# Altium schematic sheet camera_hdmi.SchDoc
size 431 x 279 mm; SheetNumber: 4; SheetTotal: 5
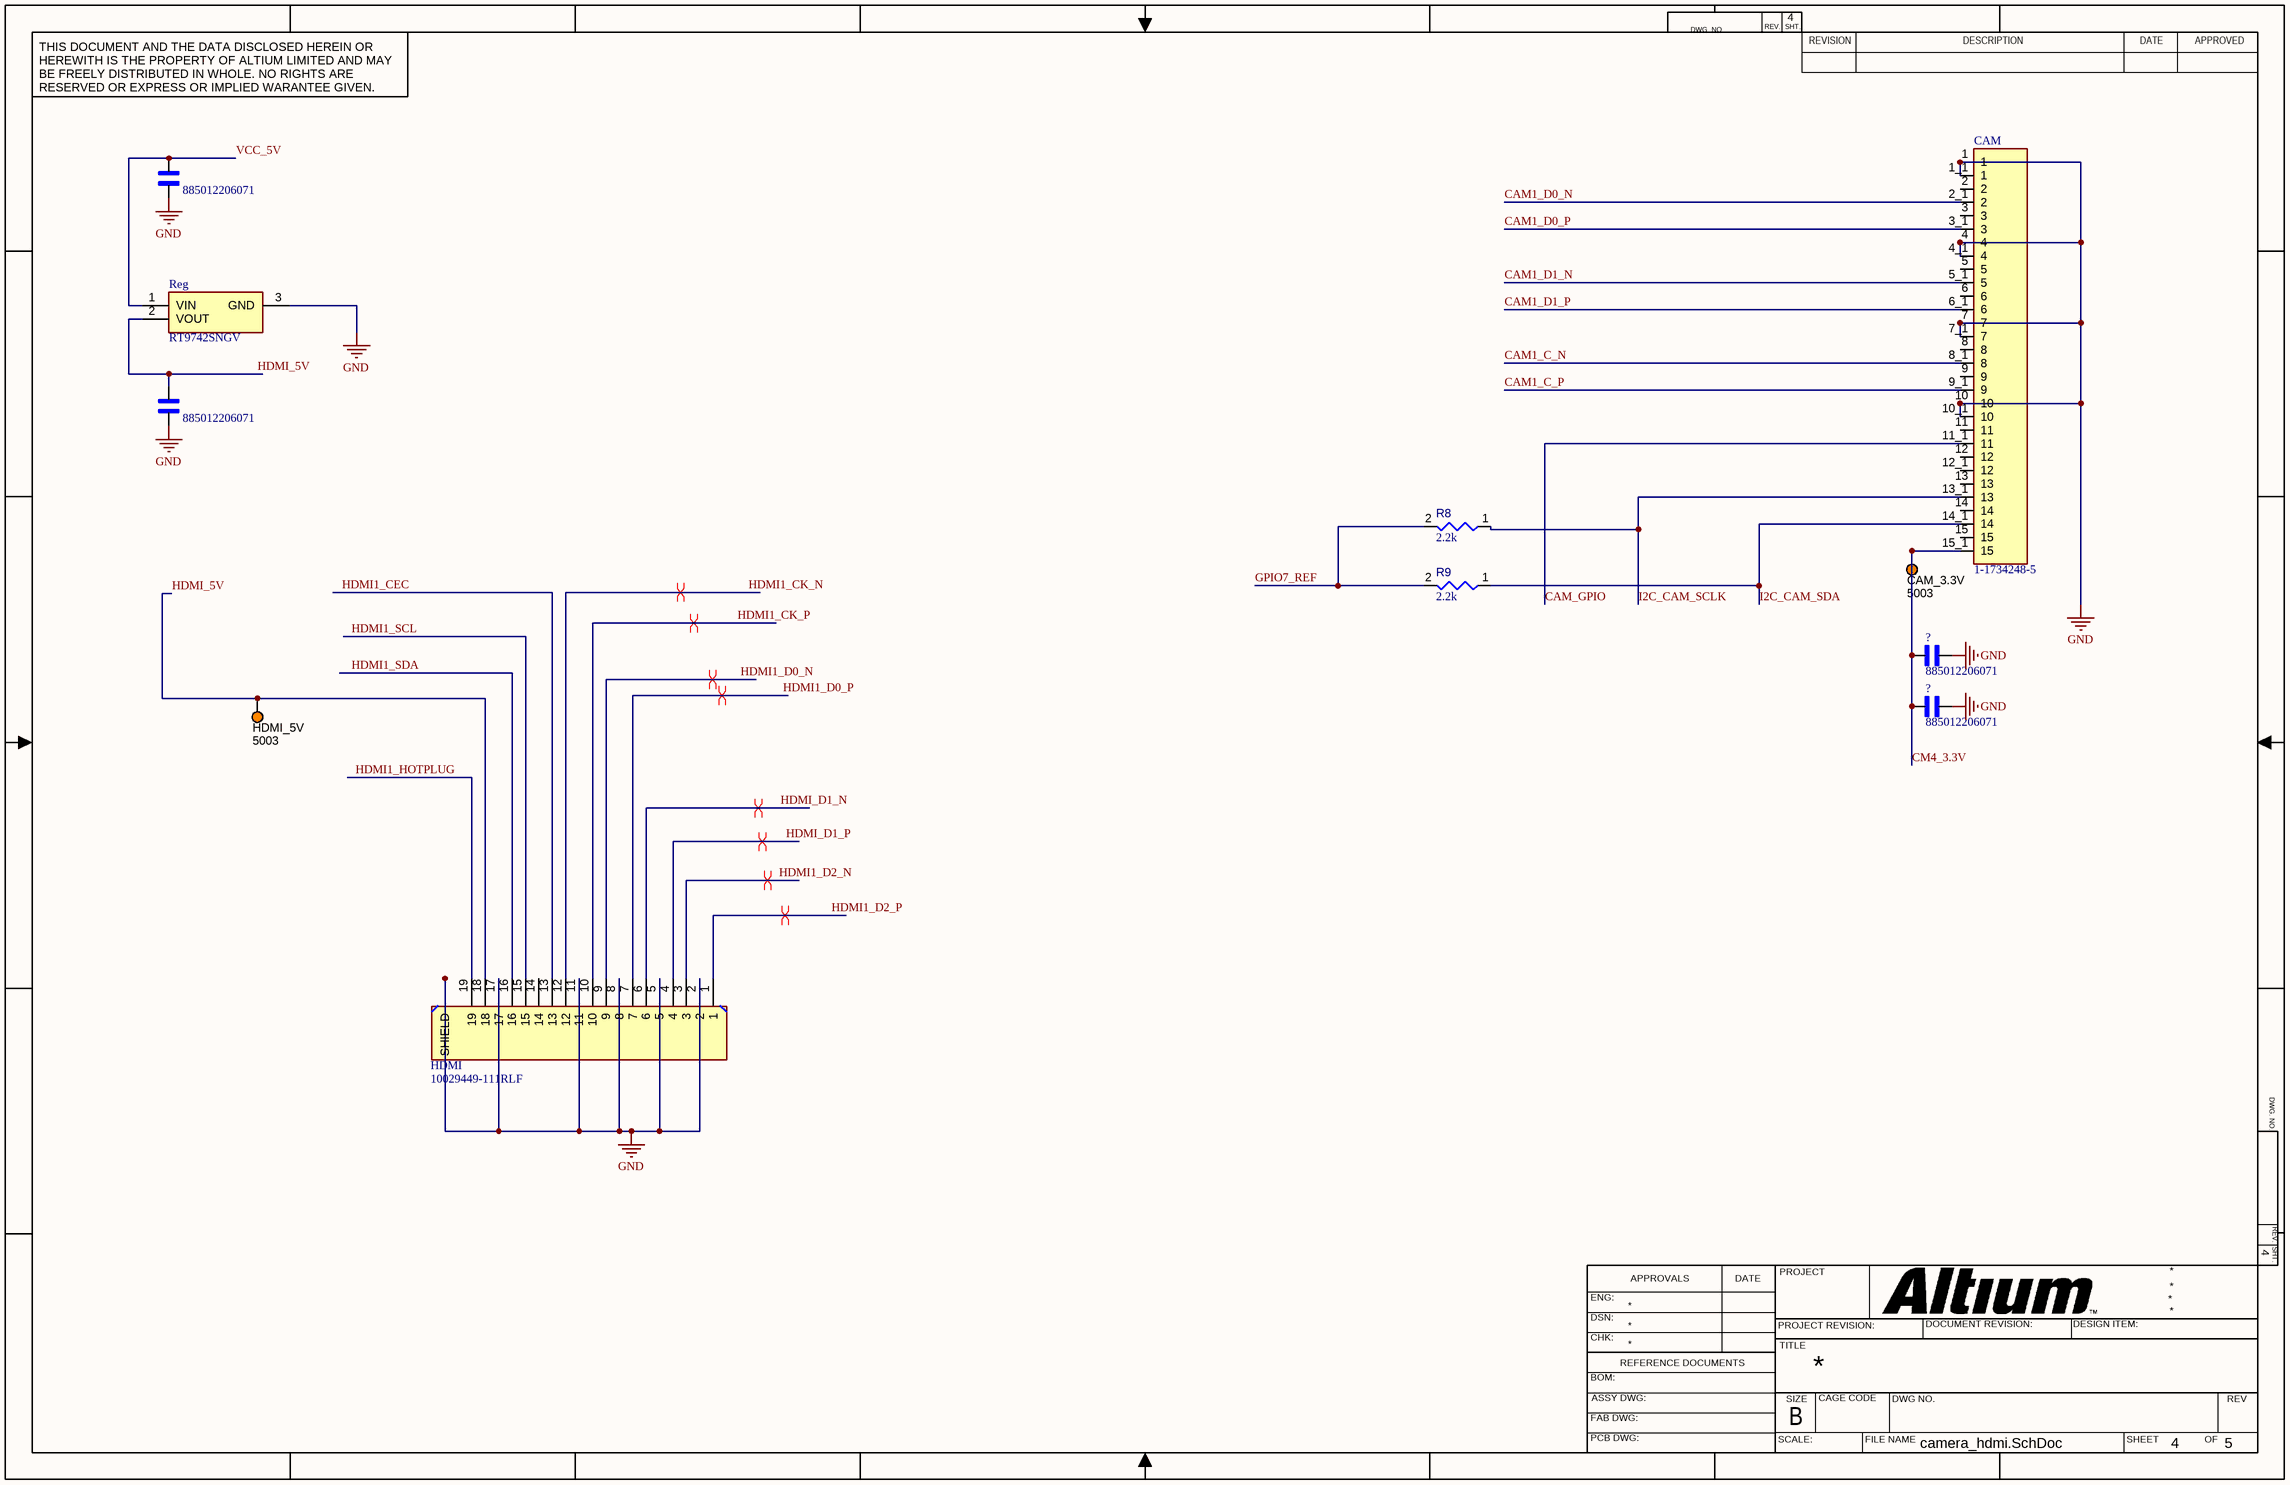
[diagram p0: camera_hdmi.SchDoc]

## Parts
(Parts that share a designator on the sheet are numbered #1, #2 ... from top to bottom, then left to right.)
?#1  885012206071  [WCAP-CSGP_885012206071]
?#2  885012206071  [WCAP-CSGP_885012206071]
?#3  885012206071  [WCAP-CSGP_885012206071]
?#4  885012206071  [WCAP-CSGP_885012206071]
CAM  1-1734248-5  [TE_1-1734248-5]
CAM_3.3V  5003  [KSTN-5003]
HDMI  10029449-111RLF  [AMPHENOL_10029449-111RLF]
HDMI_5V  5003  [KSTN-5003]
R8  value 2.2k  [RESC2013X50X35ML15T15]  (hidden comment: Resistor 10k +/-1% 0805 125 mW)
R9  value 2.2k  [RESC2013X50X35ML15T15]  (hidden comment: Resistor 10k +/-1% 0805 125 mW)
Reg  RT9742SNGV  [SOT95P279X130-3N]

## Nets
GND: ?#1.2 ?#2.2 ?#3.2 ?#4.2 CAM.1 CAM.1_1(1) CAM.4 CAM.4_1(4) CAM.7 CAM.7_1(7) CAM.10 CAM.10_1(10) HDMI.2 HDMI.5 HDMI.8 HDMI.11 HDMI.17 HDMI.S1(SHIELD) HDMI.S2(SHIELD) HDMI.S3(SHIELD) HDMI.S4(SHIELD) Reg.3(GND)
CAM1_C_N: CAM.8_1(8)
CAM1_C_P: CAM.9_1(9)
CAM1_D0_N: CAM.2_1(2)
CAM1_D0_P: CAM.3_1(3)
CAM1_D1_N: CAM.5_1(5)
CAM1_D1_P: CAM.6_1(6)
CAM_GPIO: CAM.11_1(11)
CM4_3.3V: ?#3.1 ?#4.1 CAM.15_1(15) CAM_3.3V.1
GPIO7_REF: R8.2 R9.2
HDMI1_CEC: HDMI.13
HDMI1_CK_N: HDMI.12
HDMI1_CK_P: HDMI.10
HDMI1_D0_N: HDMI.9
HDMI1_D0_P: HDMI.7
HDMI1_D2_N: HDMI.3
HDMI1_D2_P: HDMI.1
HDMI1_HOTPLUG: HDMI.19
HDMI1_SCL: HDMI.15
HDMI1_SDA: HDMI.16
HDMI_5V: ?#2.1 HDMI.18 HDMI_5V.1 Reg.2(VOUT)
HDMI_D1_N: HDMI.6
HDMI_D1_P: HDMI.4
I2C_CAM_SCLK: CAM.13_1(13) R8.1
I2C_CAM_SDA: CAM.14_1(14) R9.1
VCC_5V: ?#1.1 Reg.1(VIN)

Not connected (* = marked no-connect by the designer): CAM 2 3 5 6 8 9 11 12 12_1(12) 13 14 15; HDMI 14

## Layout directives
differential pair: HDMI1_CK_N, HDMI1_CK_P, HDMI1_D0_N, HDMI1_D0_P, HDMI1_D2_N, HDMI1_D2_P, HDMI_D1_N, HDMI_D1_P

## Notes on the sheet
- DWG. NO.
- REV.
- SHT.
- THIS DOCUMENT AND THE DATA DISCLOSED HEREIN OR HEREWITH IS THE PROPERTY OF ALTIUM LIMITED AND MAY BE FREELY DISTRIBUTED IN WHOLE. NO RIGHTS ARE RESERVED OR EXPRESS OR IMPLIED WARANTEE GIVEN.
- REVISION
- DESCRIPTION
- DATE
- APPROVED
- ENG:
- APPROVALS
- PROJECT
- DSN:
- CHK:
- REFERENCE DOCUMENTS
- PROJECT REVISION:
- TITLE
- DOCUMENT REVISION:
- DESIGN ITEM:
- BOM:
- FAB DWG:
- PCB DWG:
- ASSY DWG:
- SCALE:
- SIZE
- B
- CAGE CODE
- FILE NAME
- DWG NO.
- SHEET
- OF
- REV

## Library data of the parts
?#1-?#4 = 885012206071: WCAP-CSGP General Purpose MLCC; SMT 0603; X7R; 100nF 10%; 25V; -55C to +125C; Tech. PN X7R0603104K025DFCT10000; MF: Wurth Electronics Inc; Package: 0603 Wurth Electronics; Purchase-URL: https://pricing.snapeda.com/search/part/885012206071/?ref=eda; Price: None; Value: *; Availability: Warning; MP: 885012206071; SnapEDA_Link: https://www.snapeda.com/parts/885012206071/Wurth%20Electronics%20Inc/view-part/4217095/?ref=snap
CAM = 1-1734248-5: FPC CONNECTOR, RECEPTACLE 15POS 1MMPITCH; Series:FPC; Gender:Receptacle; Pitch S; MF: TE Connectivity; EU_RoHS_Compliance: Compliant; MP: 1-1734248-5; TE_purchase_URL: https://www.te.com/usa-en/product-1-1734248-5.html?te_bu=Cor&te_type=disp&te_campaign=seda_glo_cor-seda-global-disp-prtnr-fy19-seda-model-bom-cta_sma-317_1&elqCampaignId=32493; SnapEDA_Link: https://www.snapeda.com/parts/1-1734248-5/TE%20Connectivity%20AMP%20Connectors/view-part/822357/?ref=snap; Package: None; Digi-Key_Purchase_URL: https://www.digikey.com/product-detail/en/te-connectivity-amp-connectors/1-1734248-5/A101418CT-ND/2567554?utm_source=snapeda&utm_medium=aggregator&utm_campaign=symbol; Digi-Key_Part_Number: A101418CT-ND; Value: *
CAM_3.3V HDMI_5V = CMP-002-00037-2: Test Point, Orange, Height 4.6 mm, Tail Length 3 mm, 1-Pin THD, RoHS; Manufacturer: Keystone; Colour: Orange; Packaging: Bulk; Package Description: 1-Pin Through Hole Device, Dia 2.54 mm; Pins: 1; Package Reference: 5003; Datasheet Version: Jun-15; Case/Package: 5003; Mounting Technology: TH; Connector Type: TestPoint; Diameter: 2.54mm; Contact Material: Bronze; Datasheet URL: http://keyelco.com/userAssets/file/M65p56.pdf; Manufacturer URL: http://www.keyelco.com/; Package Quantity: 10; Contact Plating: Tin; RoHS Compliant: True
HDMI = 10029449-111RLF: HDMI, Input Output Connectors, Receptacle, Type A, Right Angle, Surface Mount, 19 Positions.; MF: AMPHENOL ICC / FCI; SnapEDA_Link: https://www.snapeda.com/parts/10029449-111RLF/Amphenol/view-part/?ref=snap; Package: None; Value: *; MP: 10029449-111RLF; Check_prices: https://www.snapeda.com/parts/10029449-111RLF/Amphenol/view-part/?ref=eda
R8 R9 = CMP-009-00018-5: Chip Resistor, 10 KOhm, +/- 1%, 125 mW, -55 to 155 degC, 0805 (2012 Metric); Power: 125mW; Voltage Rating: 150V; Tolerance: 1%; Pins: 2; Min Operating Temperature: -55°C; Case/Package: 0805; Max Operating Temperature: 155°C; RoHS Compliant: True; Mounting Technology: SM
Reg = RT9742SNGV: IC PWR SWITCH N-CHAN 1:1 SOT23-3; Manufacturer_Name: RICHTEK; Geometry.Height: 1.295mm; Manufacturer_Part_Number: RT9742SNGV; Mouser Part Number: *; Mouser Price/Stock: *; Arrow Part Number: *; Arrow Price/Stock: *; Datasheet Link: https://datasheet.lcsc.com/szlcsc/Richtek-Tech-RT9742ANGJ5F_C147955.pdf